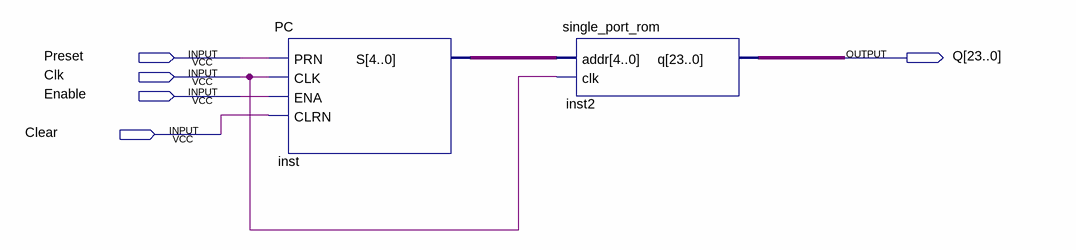
[diagram p0: schematic sheet]
// Quartus schematic Fetch.bdf as structural Verilog: 2 symbols, 5 pins
module Fetch (
  input  Preset,
  input  Clk,
  input  Enable,
  input  Clear,
  output [23:0] Q
);

  wire [4:0] inst_s;

  PC inst (.PRN(Preset), .CLK(Clk), .ENA(Enable), .CLRN(Clear), .S(inst_s));
  single_port_rom inst2 (.addr(inst_s), .clk(Clk), .q(Q));
endmodule
